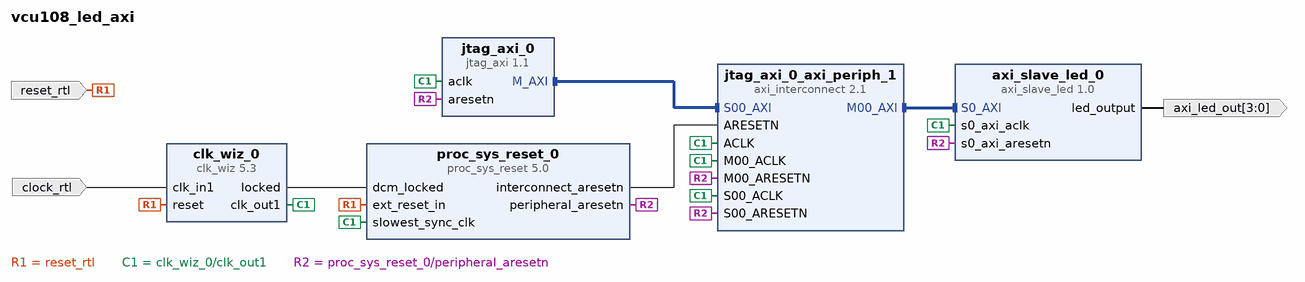
[diagram p0: block diagram of the top level]
# Vivado block design vcu108_led_axi, Vivado 2016.2
create_bd_design vcu108_led_axi

create_bd_port -dir I -type rst reset_rtl
set_property -dict {CONFIG.POLARITY ACTIVE_HIGH} [get_bd_ports reset_rtl]
create_bd_port -dir I -type clk clock_rtl
set_property -dict {CONFIG.FREQ_HZ 125000000 CONFIG.PHASE 0.000} [get_bd_ports clock_rtl]
create_bd_port -dir O -from 3 -to 0 axi_led_out

create_bd_cell -type ip -vlnv xilinx.com:ip:clk_wiz:5.3 clk_wiz_0
set_property -dict [list \
  CONFIG.PRIM_IN_FREQ 125 \
  CONFIG.CLKIN1_JITTER_PS 80.0 \
  CONFIG.CLKOUT1_REQUESTED_OUT_FREQ 50 \
  CONFIG.MMCM_DIVCLK_DIVIDE 1 \
  CONFIG.MMCM_CLKFBOUT_MULT_F 8.000 \
  CONFIG.MMCM_CLKIN1_PERIOD 8.0 \
  CONFIG.MMCM_CLKOUT0_DIVIDE_F 20.000 \
  CONFIG.CLKOUT1_JITTER 143.688 \
  CONFIG.CLKOUT1_PHASE_ERROR 96.948 \
] [get_bd_cells clk_wiz_0]
create_bd_cell -type ip -vlnv xilinx.com:ip:jtag_axi:1.1 jtag_axi_0
create_bd_cell -type ip -vlnv user.org:user:axi_slave_led:1.0 axi_slave_led_0
create_bd_cell -type ip -vlnv xilinx.com:ip:proc_sys_reset:5.0 proc_sys_reset_0
set_property -dict {CONFIG.C_AUX_RESET_HIGH 0} [get_bd_cells proc_sys_reset_0]
create_bd_cell -type ip -vlnv xilinx.com:ip:axi_interconnect:2.1 jtag_axi_0_axi_periph_1
set_property -dict {CONFIG.NUM_MI 1} [get_bd_cells jtag_axi_0_axi_periph_1]

# ---- connections ----

connect_bd_intf_net [get_bd_intf_pins jtag_axi_0/M_AXI] [get_bd_intf_pins jtag_axi_0_axi_periph_1/S00_AXI]
connect_bd_intf_net [get_bd_intf_pins jtag_axi_0_axi_periph_1/M00_AXI] [get_bd_intf_pins axi_slave_led_0/S0_AXI]
connect_bd_net [get_bd_ports reset_rtl] [get_bd_pins clk_wiz_0/reset] [get_bd_pins proc_sys_reset_0/ext_reset_in]
connect_bd_net [get_bd_ports clock_rtl] [get_bd_pins clk_wiz_0/clk_in1]
connect_bd_net [get_bd_pins clk_wiz_0/clk_out1] \
  [get_bd_pins jtag_axi_0/aclk] [get_bd_pins proc_sys_reset_0/slowest_sync_clk] [get_bd_pins axi_slave_led_0/s0_axi_aclk] \
  [get_bd_pins jtag_axi_0_axi_periph_1/S00_ACLK] [get_bd_pins jtag_axi_0_axi_periph_1/ACLK] \
  [get_bd_pins jtag_axi_0_axi_periph_1/M00_ACLK]
connect_bd_net [get_bd_pins proc_sys_reset_0/peripheral_aresetn] \
  [get_bd_pins jtag_axi_0/aresetn] [get_bd_pins axi_slave_led_0/s0_axi_aresetn] \
  [get_bd_pins jtag_axi_0_axi_periph_1/S00_ARESETN] [get_bd_pins jtag_axi_0_axi_periph_1/M00_ARESETN]
connect_bd_net [get_bd_pins clk_wiz_0/locked] [get_bd_pins proc_sys_reset_0/dcm_locked]
connect_bd_net [get_bd_pins proc_sys_reset_0/interconnect_aresetn] [get_bd_pins jtag_axi_0_axi_periph_1/ARESETN]
connect_bd_net [get_bd_pins axi_slave_led_0/led_output] [get_bd_ports axi_led_out]

# ---- address map ----
assign_bd_address -offset 0x40000000 -range 64K -target_address_space [get_bd_addr_spaces jtag_axi_0/Data] [get_bd_addr_segs axi_slave_led_0/S0_AXI/S0_AXI_reg]

validate_bd_design
save_bd_design
